# EAGLE design 3bpV2A_Opt (EAGLE 9.6.2)
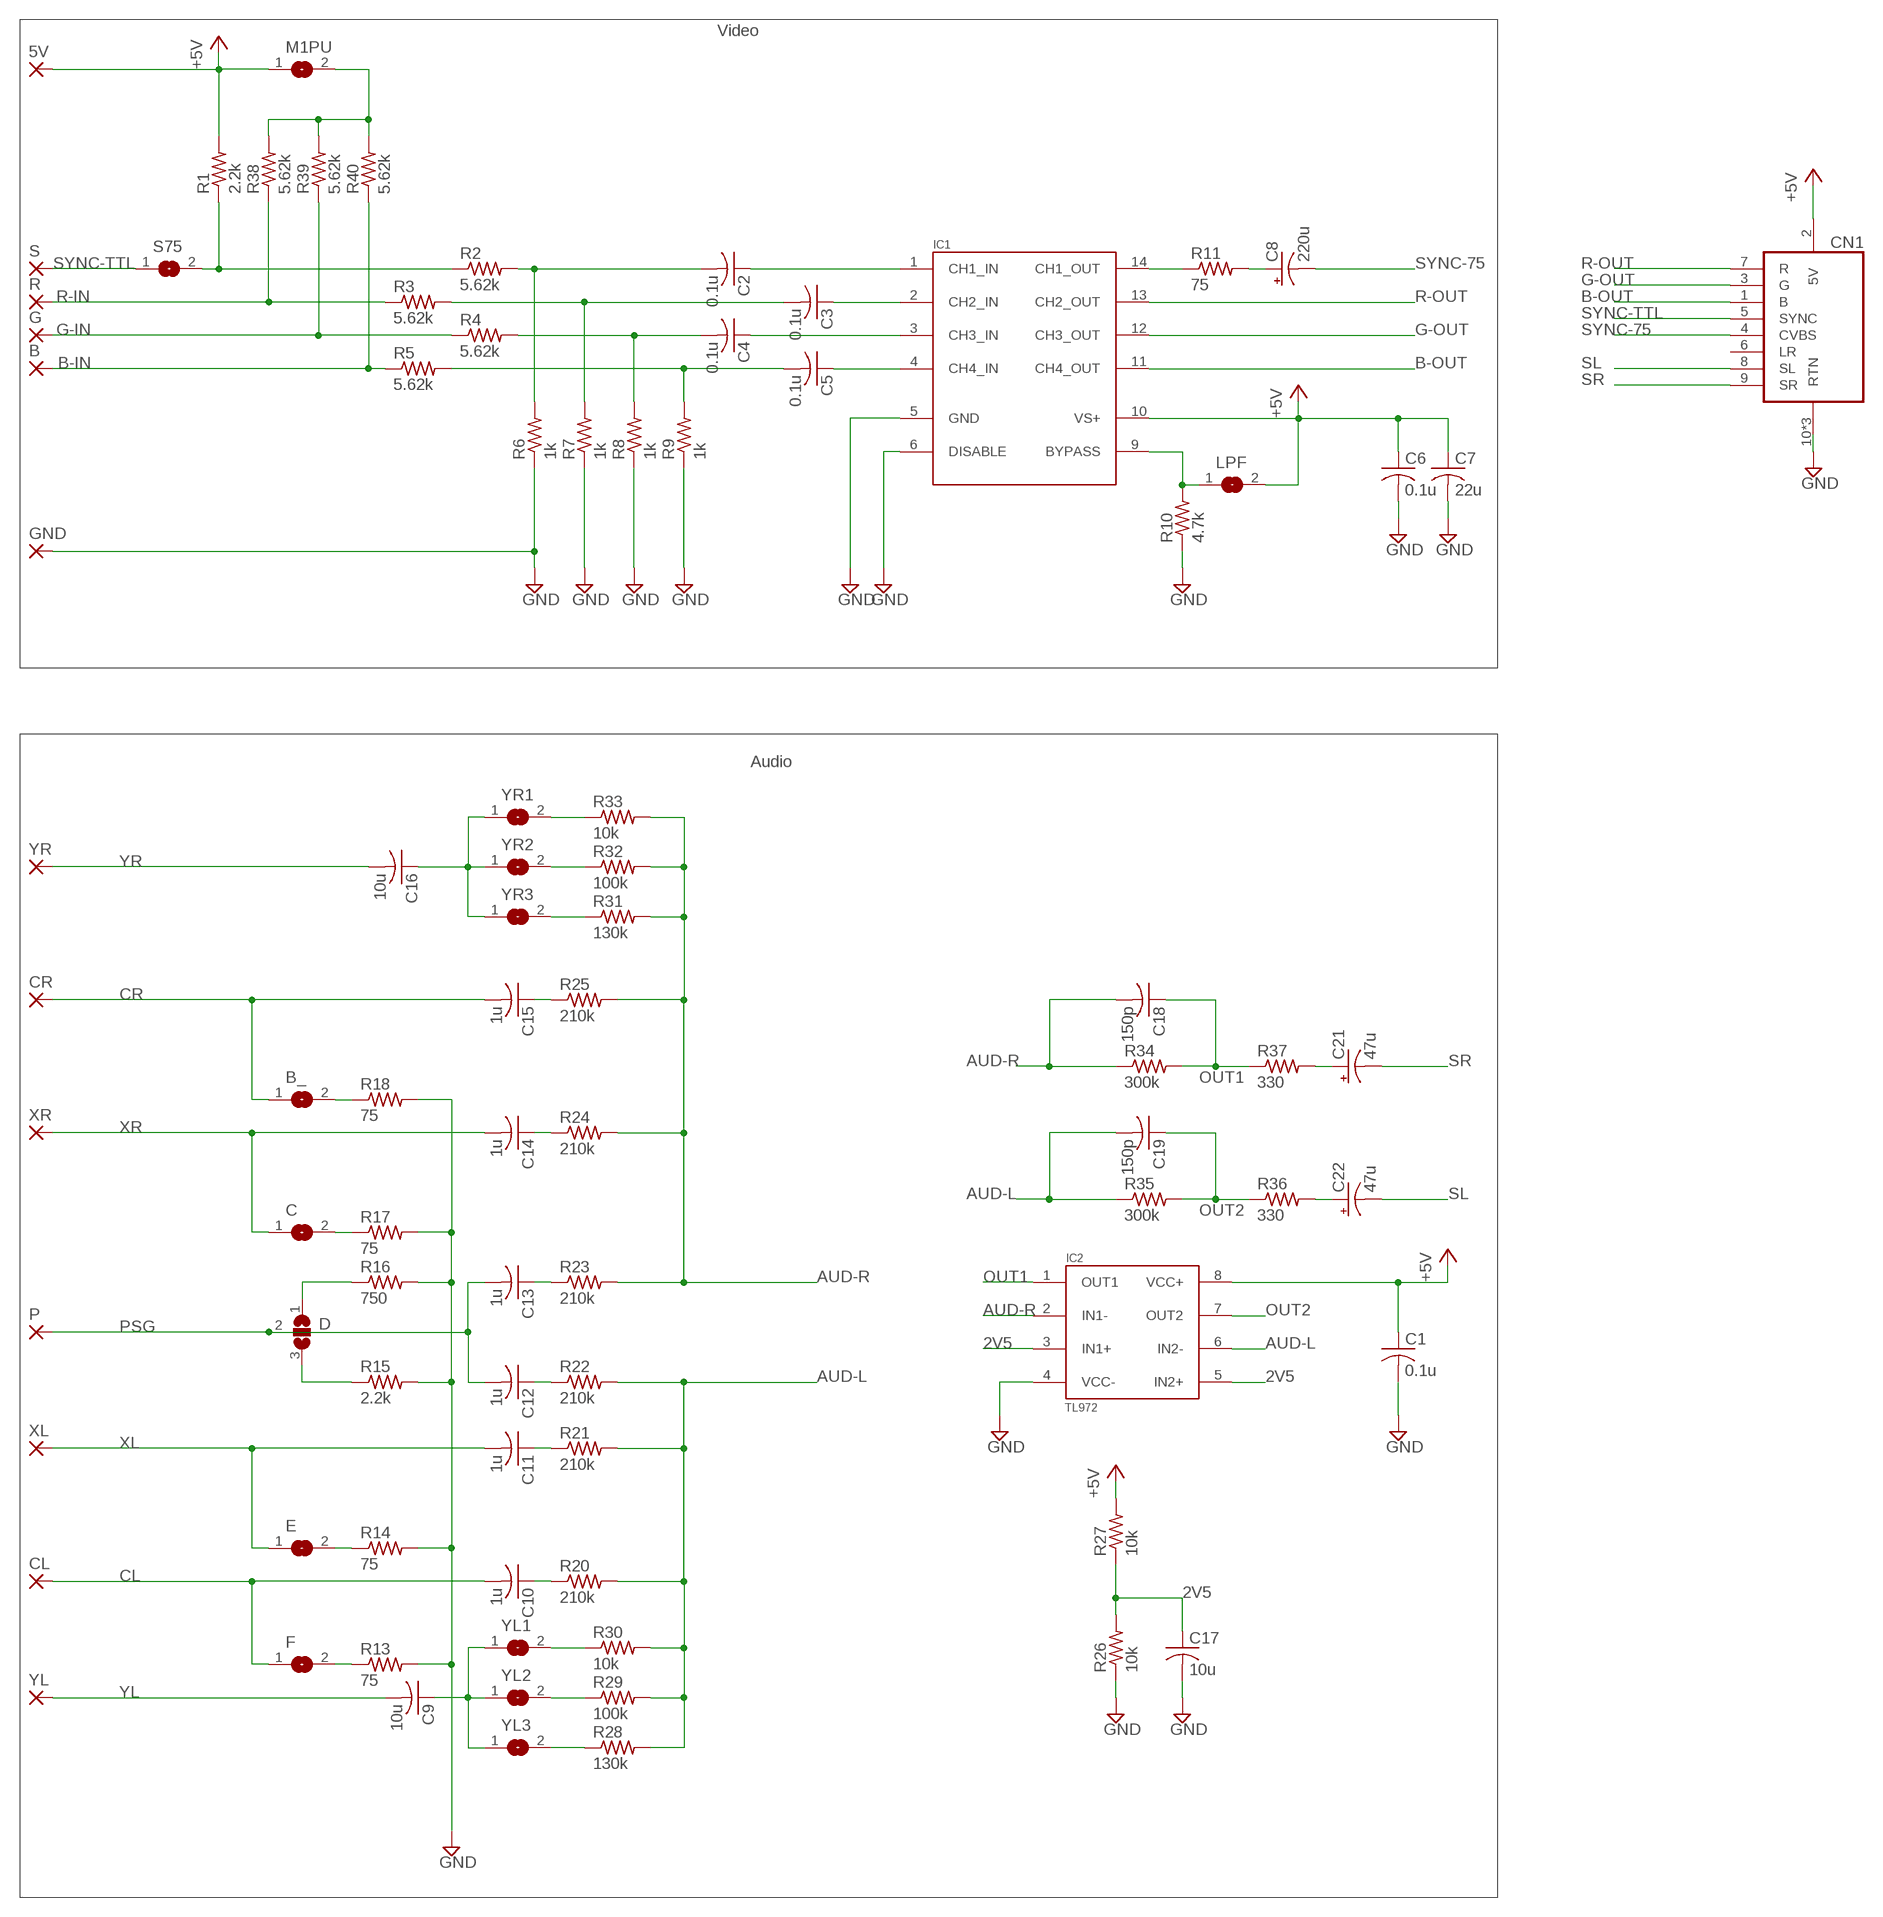
[diagram p0: schematic, sheet 1]

## Parts
5V  SMD2  [SMD1,27-2,54]
B  SMD2  [SMD1,27-2,54]
B_  SMD_J  [SJ]
C  SMD_J  [SJ]
C1  0.1u  C-USC0603  [C0603]
C2  0.1u  C-USC0603  [C0603]
C3  0.1u  C-USC0603  [C0603]
C4  0.1u  C-USC0603  [C0603]
C5  0.1u  C-USC0603  [C0603]
C6  0.1u  C-USC0603  [C0603]
C7  22u  C-USC1206  [C1206]
C8  220u  CPOL-USCT3528  [CT3528]
C9  10u  C-USC0805  [C0805]
C10  1u  C-USC0603  [C0603]
C11  1u  C-USC0603  [C0603]
C12  1u  C-USC0603  [C0603]
C13  1u  C-USC0603  [C0603]
C14  1u  C-USC0603  [C0603]
C15  1u  C-USC0603  [C0603]
C16  10u  C-USC0805  [C0805]
C17  10u  C-USC1206  [C1206]
C18  150p  C-USC0603  [C0603]
C19  150p  C-USC0603  [C0603]
C21  47u  CPOL-USCT3528  [CT3528]
C22  47u  CPOL-USCT3528  [CT3528]
CL  SMD2  [SMD1,27-2,54]
CN1  MD-90SM  [MD90SM]
CR  SMD2  [SMD1,27-2,54]
D  SMD_J2  [SJ_2]
E  SMD_J  [SJ]
F  SMD_J  [SJ]
G  SMD2  [SMD1,27-2,54]
GND  SMD2  [SMD1,27-2,54]
IC1  THS7374IPWR  [TSSOP14]
IC2  TL972  [SOIC8]
LPF  SMD_J  [SJ]
M1PU  SMD_J  [SJ]
P  SMD2  [SMD1,27-2,54]
R  SMD2  [SMD1,27-2,54]
R1  2.2k  R-US_R0603  [R0603]
R2  5.62k  R-US_R0603  [R0603]
R3  5.62k  R-US_R0603  [R0603]
R4  5.62k  R-US_R0603  [R0603]
R5  5.62k  R-US_R0603  [R0603]
R6  1k  R-US_R0603  [R0603]
R7  1k  R-US_R0603  [R0603]
R8  1k  R-US_R0603  [R0603]
R9  1k  R-US_R0603  [R0603]
R10  4.7k  R-US_R0603  [R0603]
R11  75  R-US_R0603  [R0603]
R13  75  R-US_R0603  [R0603]
R14  75  R-US_R0603  [R0603]
R15  2.2k  R-US_R0603  [R0603]
R16  750  R-US_R0603  [R0603]
R17  75  R-US_R0603  [R0603]
R18  75  R-US_R0603  [R0603]
R20  210k  R-US_R0603  [R0603]
R21  210k  R-US_R0603  [R0603]
R22  210k  R-US_R0603  [R0603]
R23  210k  R-US_R0603  [R0603]
R24  210k  R-US_R0603  [R0603]
R25  210k  R-US_R0603  [R0603]
R26  10k  R-US_R0603  [R0603]
R27  10k  R-US_R0603  [R0603]
R28  130k  R-US_R0603  [R0603]
R29  100k  R-US_R0603  [R0603]
R30  10k  R-US_R0603  [R0603]
R31  130k  R-US_R0603  [R0603]
R32  100k  R-US_R0603  [R0603]
R33  10k  R-US_R0603  [R0603]
R34  300k  R-US_R0603  [R0603]
R35  300k  R-US_R0603  [R0603]
R36  330  R-US_R0603  [R0603]
R37  330  R-US_R0603  [R0603]
R38  5.62k  R-US_R0603  [R0603]
R39  5.62k  R-US_R0603  [R0603]
R40  5.62k  R-US_R0603  [R0603]
S  SMD2  [SMD1,27-2,54]
S75  SMD_J  [SJ]
XL  SMD2  [SMD1,27-2,54]
XR  SMD2  [SMD1,27-2,54]
YL  SMD2  [SMD1,27-2,54]
YL1  SMD_J  [SJ]
YL2  SMD_J  [SJ]
YL3  SMD_J  [SJ]
YR  SMD2  [SMD1,27-2,54]
YR1  SMD_J  [SJ]
YR2  SMD_J  [SJ]
YR3  SMD_J  [SJ]

## Nets
2V5: C17.1 IC2.3(IN1+) IC2.5(IN2+) R26.2 R27.1
+5V: 5V.1(P) C1.1 C6.1 C7.1 CN1.2(5V) IC1.10(VS+) IC2.8(VCC+) LPF.2 M1PU.1 R1.2 R27.2
AUD-L: C19.2 IC2.6(IN2-) R20.2 R21.2 R22.2 R28.2 R29.2 R30.2 R35.1
AUD-R: C18.2 IC2.2(IN1-) R23.2 R24.2 R25.2 R31.2 R32.2 R33.2 R34.1
B-IN: B.1(P) R5.1 R40.1
B-OUT: CN1.1(B) IC1.11(CH4_OUT)
CL: C10.2 CL.1(P) F.1
CR: B_.1 C15.2 CR.1(P)
G-IN: G.1(P) R4.1 R39.1
G-OUT: CN1.3(G) IC1.12(CH3_OUT)
GND: C1.2 C6.2 C7.2 C17.2 CN1.10(RTN) CN1.11(RTN) CN1.12(RTN) GND.1(P) IC1.5(GND) IC1.6(DISABLE) IC2.4(VCC-) R6.1 R7.1 R8.1 R9.1 R10.1 R13.2 R14.2 R15.2 R16.2 R17.2 R18.2 R26.1
N$1: C2.2 R2.2 R6.2
N$2: C2.1 IC1.1(CH1_IN)
N$3: C3.2 R3.2 R7.2
N$4: C3.1 IC1.2(CH2_IN)
N$5: C4.2 R4.2 R8.2
N$6: C4.1 IC1.3(CH3_IN)
N$7: C5.1 IC1.4(CH4_IN)
N$8: C5.2 R5.2 R9.2
N$9: IC1.9(BYPASS) LPF.1 R10.2
N$10: M1PU.2 R38.2 R39.2 R40.2
N$11: B_.2 R18.1
N$12: R1.1 R2.1 S75.2
N$13: IC1.14(CH1_OUT) R11.1
N$14: C8.+ R11.2
N$16: C16.1 YR1.1 YR2.1 YR3.1
N$17: R33.1 YR1.2
N$18: R32.1 YR2.2
N$19: R31.1 YR3.2
N$20: E.2 R14.1
N$21: C15.1 R25.1
N$22: C.2 R17.1
N$23: C14.1 R24.1
N$25: D.3 R15.1
N$26: D.1 R16.1
N$27: C13.1 R23.1
N$28: C12.1 R22.1
N$30: C11.1 R21.1
N$32: F.2 R13.1
N$33: C10.1 R20.1
N$34: C9.1 YL1.1 YL2.1 YL3.1
N$35: R30.1 YL1.2
N$36: R29.1 YL2.2
N$37: R28.1 YL3.2
N$41: C22.+ R36.2
N$42: C21.+ R37.2
OUT1: C18.1 IC2.1(OUT1) R34.2 R37.1
OUT2: C19.1 IC2.7(OUT2) R35.2 R36.1
PSG: C12.2 C13.2 D.2 P.1(P)
R-IN: R3.1 R38.1 R.1(P)
R-OUT: CN1.7(R) IC1.13(CH2_OUT)
SL: C22.- CN1.8(SL)
SR: C21.- CN1.9(SR)
SYNC-75: C8.- CN1.4(CVBS)
SYNC-TTL: CN1.5(SYNC) S75.1 S.1(P)
XL: C11.2 E.1 XL.1(P)
XR: C14.2 C.1 XR.1(P)
YL: C9.2 YL.1(P)
YR: C16.2 YR.1(P)
Unconnected: CN1.6(LR)

## Notes on the sheet
- Video
- Audio

## Library data of the parts
5V B CL CR G GND P R S XL XR YL YR = wirepad:SMD2: SMD PAD
B_ C E F LPF M1PU S75 YL1-YL3 YR1-YR3 = My_Devices:SMD_J
C1-C7 C9-C19 = My_Devices:C-US: CAPACITOR, American symbol
C8 C21 C22 = My_Devices:CPOL-US: POLARIZED CAPACITOR, American symbol; SPICEPREFIX: C
CN1 = My_Devices:MD-90SM
D = My_Devices:SMD_J2
IC1 = My_Devices:THS7374
IC2 = My_Devices:TL972
R1-R11 R13-R18 R20-R40 = My_Devices:R-US_: RESISTOR, American symbol

## Board
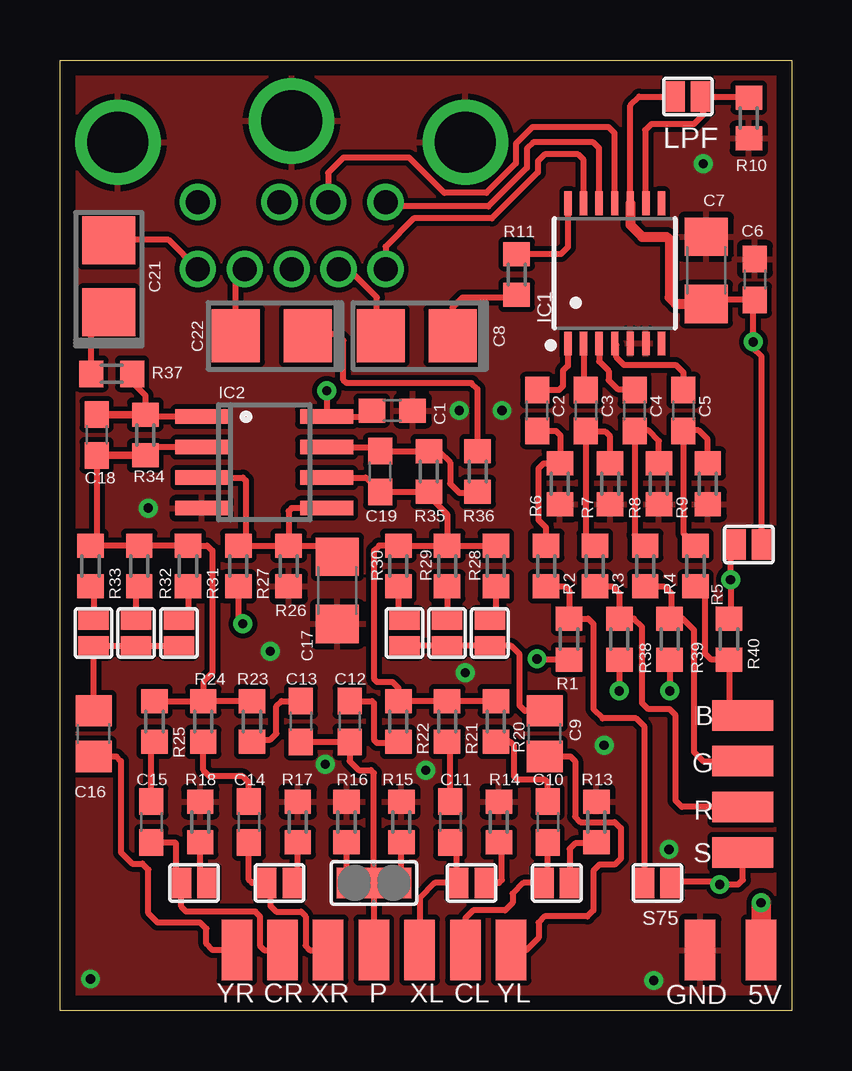
[diagram p1: board, top side]
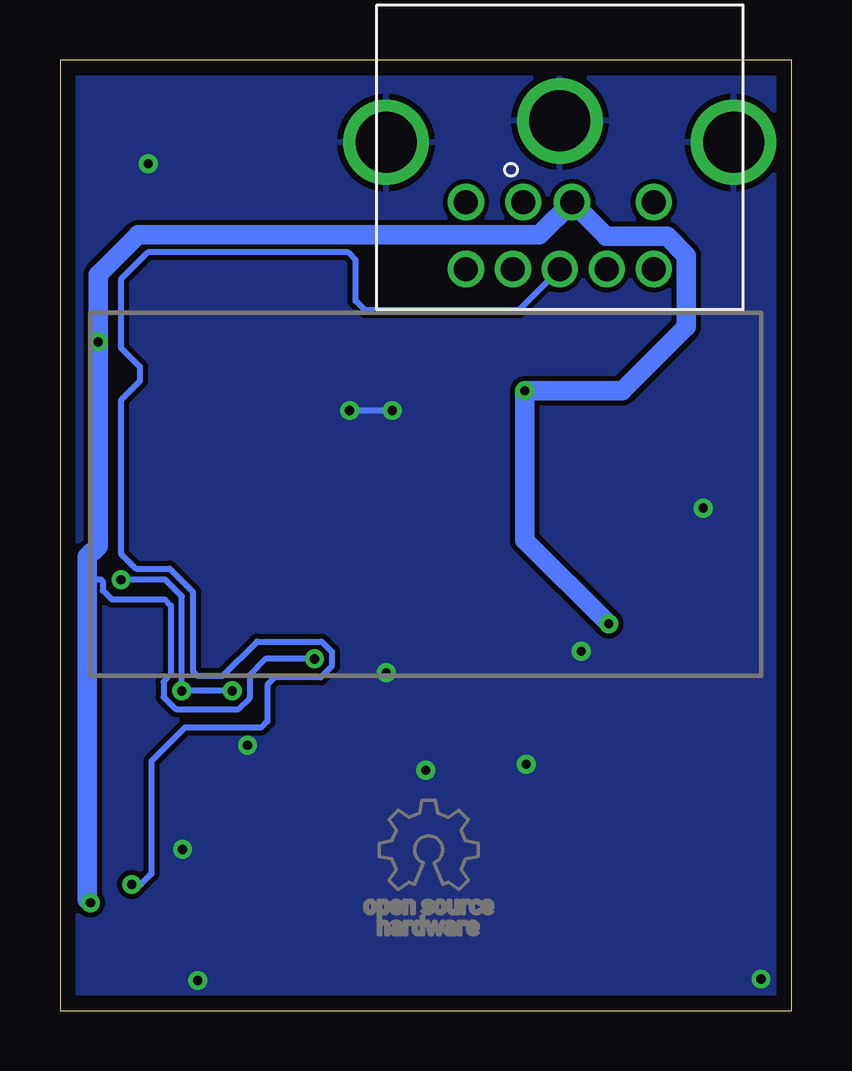
[diagram p2: board, bottom side, seen from below]

Size 30.48 x 39.62 mm. Coordinates in mm from the lower left corner, seen from the top.
Outline: 0,0 0,39.62 30.48,39.62 30.48,0 0,0
Copper layers (1*16): Top 0.035mm / dielectric 1.5mm / Bottom 0.035mm
Design rules "default *": minimum track width 10mil, minimum drill 15mil, track to track 8mil, track to pad 8mil, pad to pad 8mil, via to via 8mil, smd to smd 8mil, copper to edge 25mil, drill to drill 8mil, minimum pad ring 10mil, minimum via ring 8mil, stop-mask expansion 4mil, vias tented up to drill 18mil, thermal gap 10mil

### Footprints (pad centres in the part's own frame; a part is rotated, then mirrored left to right if it is on the bottom)
SMD1,27-2,54 = smd 1.27 x 2.54: 1 0,0
SJ = smd 0.813 x 1.27: 1 -0.533,0; 2 0.533,0
C0603 = smd 1.1 x 1: 1 -0.85,0; 2 0.85,0
C1206 = smd 1.6 x 1.8: 1 -1.4,0; 2 1.4,0
CT3528 = smd 2 x 2.2: + -1.5,0; - 1.5,0
C0805 = smd 1.3 x 1.5: 1 -0.95,0; 2 0.95,0
MD90SM = drill 1: 1 1.524,8.204; 2 -0.508,8.204; 3 3.912,8.204; 4 1.956,10.998; 5 0,10.998; 6 -3.912,8.204; 7 3.912,10.998; 8 -1.956,10.998; 9 -3.912,10.998 | drill 2.54: 10 -7.239,5.715; 11 0,4.826; 12 7.239,5.715
SJ_2 = smd 0.813 x 1.27: 1 -1.143,0; 2 0,0; 3 1.143,0
TSSOP14 = smd 0.305 x 0.991: 1 -1.95,-2.918; 2 -1.3,-2.918; 3 -0.65,-2.918; 4 0,-2.918; 5 0.65,-2.918; 6 1.3,-2.918; 7 1.95,-2.918; 8 1.95,2.918; 9 1.3,2.918; 10 0.65,2.918; 11 0,2.918; 12 -0.65,2.918; 13 -1.3,2.918; 14 -1.95,2.918
SOIC8 = smd 0.6 x 2.2: 1 -1.905,-2.6; 2 -0.635,-2.6; 3 0.635,-2.6; 4 1.905,-2.6; 5 1.905,2.6; 6 0.635,2.6; 7 -0.635,2.6; 8 -1.905,2.6
R0603 = smd 1 x 1.1: 1 -0.85,0; 2 0.85,0

### Placement (x,y rotation side)
5V  29.21,2.54 0 top
B  28.45,12.32 90 top
B_  5.59,5.33 0 top
C  9.14,5.33 0 top
C1  13.84,25.02 0 top
C2  19.88,25.02 270 top
C3  21.91,25.02 270 top
C4  23.94,25.02 270 top
C5  25.97,25.02 270 top
C6  28.96,30.48 90 top
C7  26.92,30.86 90 top
C8  14.86,28.13 180 top
C9  20.19,11.56 270 top
C10  20.32,7.87 270 top
C11  16.26,7.87 270 top
C12  12.06,12.06 270 top
C13  10.03,12.06 270 top
C14  7.87,7.87 270 top
C15  3.81,7.87 270 top
C16  1.4,11.56 270 top
C17  11.56,17.53 270 top
C18  1.52,24 270 top
C19  13.34,22.48 270 top
C21  2.03,30.61 90 top
C22  8.83,28.13 180 top
CL  16.89,2.54 0 top
CN1  9.65,41.91 180 bottom
CR  9.27,2.54 0 top
D  13.08,5.33 0 top
E  17.14,5.33 0 top
F  20.7,5.33 0 top
G  28.45,10.41 90 top
GND  26.67,2.54 180 top
IC1  23.11,30.73 0 top
IC2  8.51,22.86 270 top
LPF  26.16,38.1 180 top
M1PU  28.7,19.43 180 top
P  13.08,2.54 0 top
R  28.45,8.51 90 top
R1  21.21,15.49 270 top
R2  20.26,18.54 90 top
R3  22.29,18.54 90 top
R4  24.38,18.54 90 top
R5  26.48,18.54 90 top
R6  20.83,21.97 90 top
R7  22.92,21.97 90 top
R8  24.96,21.97 90 top
R9  26.99,21.97 90 top
R10  28.7,37.21 90 top
R11  19.02,30.68 270 top
R13  22.35,7.87 90 top
R14  18.29,7.87 90 top
R15  14.22,7.87 90 top
R16  11.94,7.87 90 top
R17  9.91,7.87 90 top
R18  5.84,7.87 90 top
R20  18.16,12.06 90 top
R21  16.13,12.06 90 top
R22  14.1,12.06 90 top
R23  8,12.06 90 top
R24  5.97,12.06 90 top
R25  3.94,12.06 90 top
R26  9.53,18.54 90 top
R27  7.43,18.54 270 top
R28  18.16,18.54 90 top
R29  16.13,18.54 90 top
R30  14.1,18.54 90 top
R31  5.33,18.54 90 top
R32  3.3,18.54 90 top
R33  1.27,18.54 90 top
R34  3.56,24 90 top
R35  15.37,22.48 90 top
R36  17.4,22.48 90 top
R37  2.16,26.54 180 top
R38  23.3,15.49 270 top
R39  25.4,15.49 270 top
R40  27.88,15.49 90 top
S  28.45,6.6 90 top
S75  24.89,5.33 180 top
XL  14.99,2.54 0 top
XR  11.18,2.54 0 top
YL  18.8,2.54 0 top
YL1  14.35,15.75 90 top
YL2  16.13,15.75 90 top
YL3  17.91,15.75 90 top
YR  7.37,2.54 0 top
YR1  1.4,15.75 90 top
YR2  3.17,15.75 90 top
YR3  4.95,15.75 90 top

### Tracks (layer width: path | path; a pad name or v marks a point on that pad's centre or on a via)
2V5
  Top 0.254: IC2.3 7.62,22.23 7.75,22.1 7.75,19.71 R27.1 R26.2 | R26.2 11.09,19.39 C17.1 | IC2.5 9.65,20.95 9.53,20.83 R26.2
+5V  (via drill 0.38)
  Top 0.254: IC1.10 23.76,37.73 24.13,38.1 LPF.2 | v11.11,25.84 IC2.8 12.74,24.77 C1.1 | R27.2 7.43,16.32 v7.62,16.13 | R1.2 19.9,14.64 v19.88,14.67 | C7.1 27.09,29.63 C6.1 28.89,29.57 v28.89,27.88 28.89,27.62 29.23,27.28 M1PU.1
  Top 0.406: IC1.10 23.76,32.75 24.26,32.26 25.27,32.26 25.4,32.13 25.4,29.72 25.65,29.46 C7.1
  Top 0.813: v29.21,4.51 5V.1
  Bottom 0.254: v19.88,14.67 21.91,14.67 22.58,13.99 22.58,13.04 23.04,12.57 25.66,12.57 26.16,13.07 26.16,13.72 25.86,14.02 25.86,16.89 26.11,17.14 28.32,17.14 28.7,17.53 28.7,17.91 28.77,17.97 29.34,17.97
  Bottom 0.813: v7.62,16.13 11.11,19.62 v11.11,25.84 7.05,25.84 4.38,28.52 4.38,31.48 5.18,32.27 7.71,32.27 CN1.2 10.51,32.34 27.22,32.34 28.89,30.67 v28.89,27.88 28.89,19.37 29.34,18.92 29.34,17.97 29.34,4.64 v29.21,4.51
AUD-L
  Top 0.254: IC2.6 12.74,22.23 C19.2 R35.1 15.37,21.46 16.13,20.7 R29.2 | R29.2 R30.2 13.3,19.39 13.08,19.18 13.08,13.84 13.21,13.72 13.84,13.72 14.1,13.46 R22.2 R21.2 R20.2 | R29.2 R28.2
AUD-R
  Top 0.254: IC2.2 3.9,23.5 R34.1 | C18.2 1.52,19.65 R33.2 R32.2 R31.2 6.13,19.39 6.35,19.18 6.35,14.1 5.97,13.72 R24.2 | R25.2 R24.2 | R23.2 R24.2
  Top 0.305: C18.2 R34.1
B-IN
  Top 0.254: R5.1 26.87,17.3 26.87,14.91 27.14,14.64 R40.1 27.88,12.89 B.1
B-OUT
  Top 0.254: IC1.11 23.11,36.58 22.86,36.83 19.68,36.83 19,36.14 19,35.32 17.76,34.09 16.02,34.09 14.54,35.56 11.81,35.56 11.18,34.92 CN1.1
CL
  Top 0.254: CL.1 16.89,3.87 17.21,4.19 18.54,4.19 18.86,4.51 18.86,4.89 19.3,5.33 F.1 20.32,5.59 C10.2
CR
  Top 0.254: CR.1 8.51,2.54 8.33,2.72 8.33,3.95 8.14,4.14 5.26,4.14 5.05,4.34 B_.1 4.83,5.56 4.83,6.99 4.79,7.02 C15.2
G-IN
  Top 0.254: R4.1 25.17,17.69 25.46,17.4 25.46,16.41 R39.1 25.95,16.34 26.42,15.88 26.42,10.79 26.8,10.41 G.1
G-OUT
  Top 0.254: IC1.12 22.46,35.96 22.23,36.2 19.71,36.2 19.46,35.94 19.46,35.13 17.85,33.53 13.74,33.53 CN1.3
GND  (via drill 0.38)
  Bottom 0.254: v16.64,25.02 v18.41,25.02
  other vias: 26.8,35.31 15.24,10.03 11.05,10.29 3.68,20.95 22.67,11.07 8.76,14.99 24.74,1.27 1.27,1.33 16.89,14.1 25.37,6.73
  pour Top: -1.27,40.64 31.75,40.64 31.75,0 -1.27,0
  pour Bottom (rank 2): -2.54,41.91 33.02,41.91 33.02,-1.27 -2.54,-1.27
N$1
  Top 0.254: C2.2 20.66,24.17 20.85,23.98 20.85,22.8 R6.2 20.15,22.82 19.94,22.61 19.94,20.45 20.26,20.13 R2.2
N$2
  Top 0.254: IC1.1 21.16,26.88 20.95,26.67 20.95,26.04 20.79,25.87 C2.1
N$3
  Top 0.254: R7.2 22.92,23.94 22.73,24.13 21.95,24.13 C3.2 21.91,19.77 R3.2
N$4
  Top 0.254: IC1.2 21.81,25.96 C3.1
N$5
  Top 0.254: R4.2 23.94,19.84 C4.2 23.96,24.19 24.51,24.19 24.96,23.75 R8.2
N$6
  Top 0.254: IC1.3 22.46,27.07 22.86,26.67 22.86,26.29 23.24,25.91 23.9,25.91 C4.1
N$7
  Top 0.254: C5.1 25.97,26.61 25.65,26.92 23.5,26.92 23.18,27.24 23.18,27.75 IC1.4
N$8
  Top 0.254: R5.2 25.97,19.9 C5.2 26,24.19 26.61,24.19 26.99,23.81 R9.2
N$9
  Top 0.254: R10.2 28.66,38.1 LPF.1 26.8,37.34 26.42,36.96 24.64,36.96 24.38,36.7 24.38,33.68 IC1.9
N$10  (via drill 0.38)
  Top 0.254: R39.2 v25.4,13.34 | R38.2 v23.3,13.34 | R40.2 27.94,16.41 v27.94,17.97 27.94,19.3 M1PU.2
  Bottom 0.254: v23.3,13.34 v25.4,13.34 25.4,17.27 26.1,17.97 v27.94,17.97
N$11
  Top 0.254: B_.2 5.84,5.61 R18.1
N$12
  Top 0.254: R2.1 21.04,17.69 21.21,17.53 R1.1 22.01,16.34 22.23,16.13 22.23,12.57 22.61,12.19 24,12.19 24.36,11.84 S75.2
N$13
  Top 0.254: IC1.14 21.16,31.83 20.86,31.53 R11.1
N$14
  Top 0.254: R11.2 18.91,29.72 16.76,29.72 16.36,29.31 C8.+
N$16
  Top 0.254: C16.1 YR1.1 YR2.1 YR3.1
N$17
  Top 0.254: R33.1 1.4,17.57 YR1.2
N$18
  Top 0.254: YR2.2 3.17,17.57 R32.1
N$19
  Top 0.254: R31.1 5.33,16.76 YR3.2
N$20
  Top 0.254: E.2 18.29,5.33 18.41,5.46 18.41,6.9 R14.1
N$21
  Top 0.254: C15.1 3.81,11.09 R25.1
N$22
  Top 0.254: C.2 9.91,5.46 R17.1
N$23
  Top 0.254: C14.1 7.87,9.53 7.62,9.78 6.22,9.78 5.97,10.03 R24.1
N$25
  Top 0.254: D.3 R15.1
N$26
  Top 0.254: D.1 R16.1
N$27
  Top 0.254: R23.1 8.09,11.3 8.76,11.3 9.02,11.56 9.02,12.7 9.23,12.91 C13.1
N$28
  Top 0.254: C12.1 12.99,12.91 13.08,12.83 13.08,11.3 13.21,11.18 14.06,11.18 R22.1
N$30
  Top 0.254: C11.1 16.26,11.09 R21.1
N$32
  Top 0.254: R13.1 22.31,6.99 21.46,6.99 21.23,6.76 F.2
N$33
  Top 0.254: C10.1 20.32,9.53 20.22,9.63 19.07,9.63 18.92,9.78 18.92,11.05 18.76,11.21 R20.1
N$34
  Top 0.254: C9.1 19.37,12.51 19.15,12.72 19.15,14.86 18.8,15.21 YL3.1 YL2.1 YL1.1
N$35
  Top 0.254: R30.1 14.1,16.54 YL1.2
N$36
  Top 0.254: R29.1 YL2.2
N$37
  Top 0.254: R28.1 18.16,16.54 YL3.2
N$41
  Top 0.254: R36.2 17.4,25.91 17.14,26.16 11.94,26.16 11.81,26.29 11.81,27.94 11.56,28.19 10.39,28.19 C22.+
N$42
  Top 0.254: R37.2 1.31,28.38 C21.+
OUT1
  Top 0.254: IC2.1 3.64,24.77 R34.2 3.56,25.65 3.01,26.2 R37.1
  Top 0.305: C18.1 R34.2
OUT2
  Top 0.254: IC2.7 13.17,23.5 C19.1 R35.2 15.79,23.33 16.26,22.86 16.26,21.97 16.64,21.59 17.36,21.59 R36.1
PSG
  Top 0.254: P.1 D.2 13.08,9.91 12.95,10.03 12.45,10.03 12.06,10.41 C12.2 C13.2
R-IN
  Top 0.254: R3.1 23.01,17.69 23.3,17.4 R38.1 23.91,16.34 24.26,16 24.26,12.83 24.51,12.57 25.4,12.57 25.65,12.32 25.65,11.43 25.65,8.76 25.91,8.51 R.1
R-OUT
  Top 0.254: IC1.13 21.81,35.46 21.59,35.69 20.19,35.69 19.91,35.41 19.91,34.94 17.99,33.02 14.73,33.02 13.56,31.85 CN1.7
SL
  Top 0.254: C22.- 7.33,30.54 CN1.8
SR
  Top 0.254: CN1.9 4.52,32.13 2.06,32.13 C21.-
SYNC-75
  Top 0.254: C8.- 13.21,28.28 13.21,29.73 12.03,30.91 CN1.4
SYNC-TTL  (via drill 0.38)
  Top 0.254: S75.1 25.59,5.4 27.37,5.4 v27.5,5.27 28.26,5.27 28.45,5.46 S.1
  Bottom 0.254: CN1.5 11.35,29.21 17.78,29.21 18.16,29.59 18.16,31.29 18.48,31.61 26.81,31.61 27.94,30.48 27.94,27.63 27.15,26.84 27.15,26.24 27.94,25.46 27.94,19.05 27.32,18.43 25.91,18.43 24.94,17.46 24.94,14.15 24.77,13.97 23.69,13.97 22.27,15.39 19.58,15.39 19.15,14.97 19.15,14.37 19.62,13.9 21.53,13.9 21.84,13.59 21.84,12.06 22.1,11.81 25.27,11.81 26.67,10.41 26.67,5.71 27.11,5.27 v27.5,5.27
XL
  Top 0.254: E.1 16.51,5.33 | 16.51,5.33 15.62,5.33 14.99,4.7 XL.1 | C11.2 16.51,6.77 16.51,5.33
XR
  Top 0.254: XR.1 10.41,2.54 10.24,2.72 10.24,3.95 10.04,4.14 9,4.14 8.76,4.38 8.76,5.08 C.1 8,5.33 7.87,5.46 C14.2
YL
  Top 0.254: C9.2 21.27,10.61 21.46,10.41 21.46,8.1 21.68,7.87 23.11,7.87 23.37,7.62 23.37,6.35 23.11,6.1 22.48,6.1 22.23,5.84 22.23,4.19 21.97,3.94 20.19,3.94 19.94,3.68 19.94,3.05 19.43,2.54 YL.1
YR
  Top 0.254: YR.1 6.35,2.54 6.1,2.79 6.1,3.43 5.84,3.68 4.06,3.68 3.68,4.06 3.68,5.89 3.43,6.14 3,6.14 2.54,6.6 2.54,10.41 2.35,10.61 C16.2

### Text on the board
tDocu: 3BP | V2A | + | + | + | M1 / PU | 1 | 2 | 3 | 1 | 2 | 3 | c | d | e | b | f
bDocu: 5v | B | G | SR | SL | STTL | S75 | R | M1va0-6.5 = 1, M1PU / M1va7 = 2, c, d-right, e, M1PU | M2va0-1.8 = 2, c, d-right, e / M2Va3 = 2 / M2va2-2.3 = 1, d-left / M2va4 = 3, d-right | M3 = 3, b, c, d-right, e, f | S75 = 75 Ohm CSYNC to Pin 4 | TRIPLE BYPASS V2A | Updated Design: | Original Design: / dbElectronics | @zaxour | Ace / MobiusStripTech / FirebrandX | RetroRGB / Cruzlink2 / Artemio | Licensed under / CERN OHL v1.2